# Altium schematic sheet Sensors.SchDoc
size A3
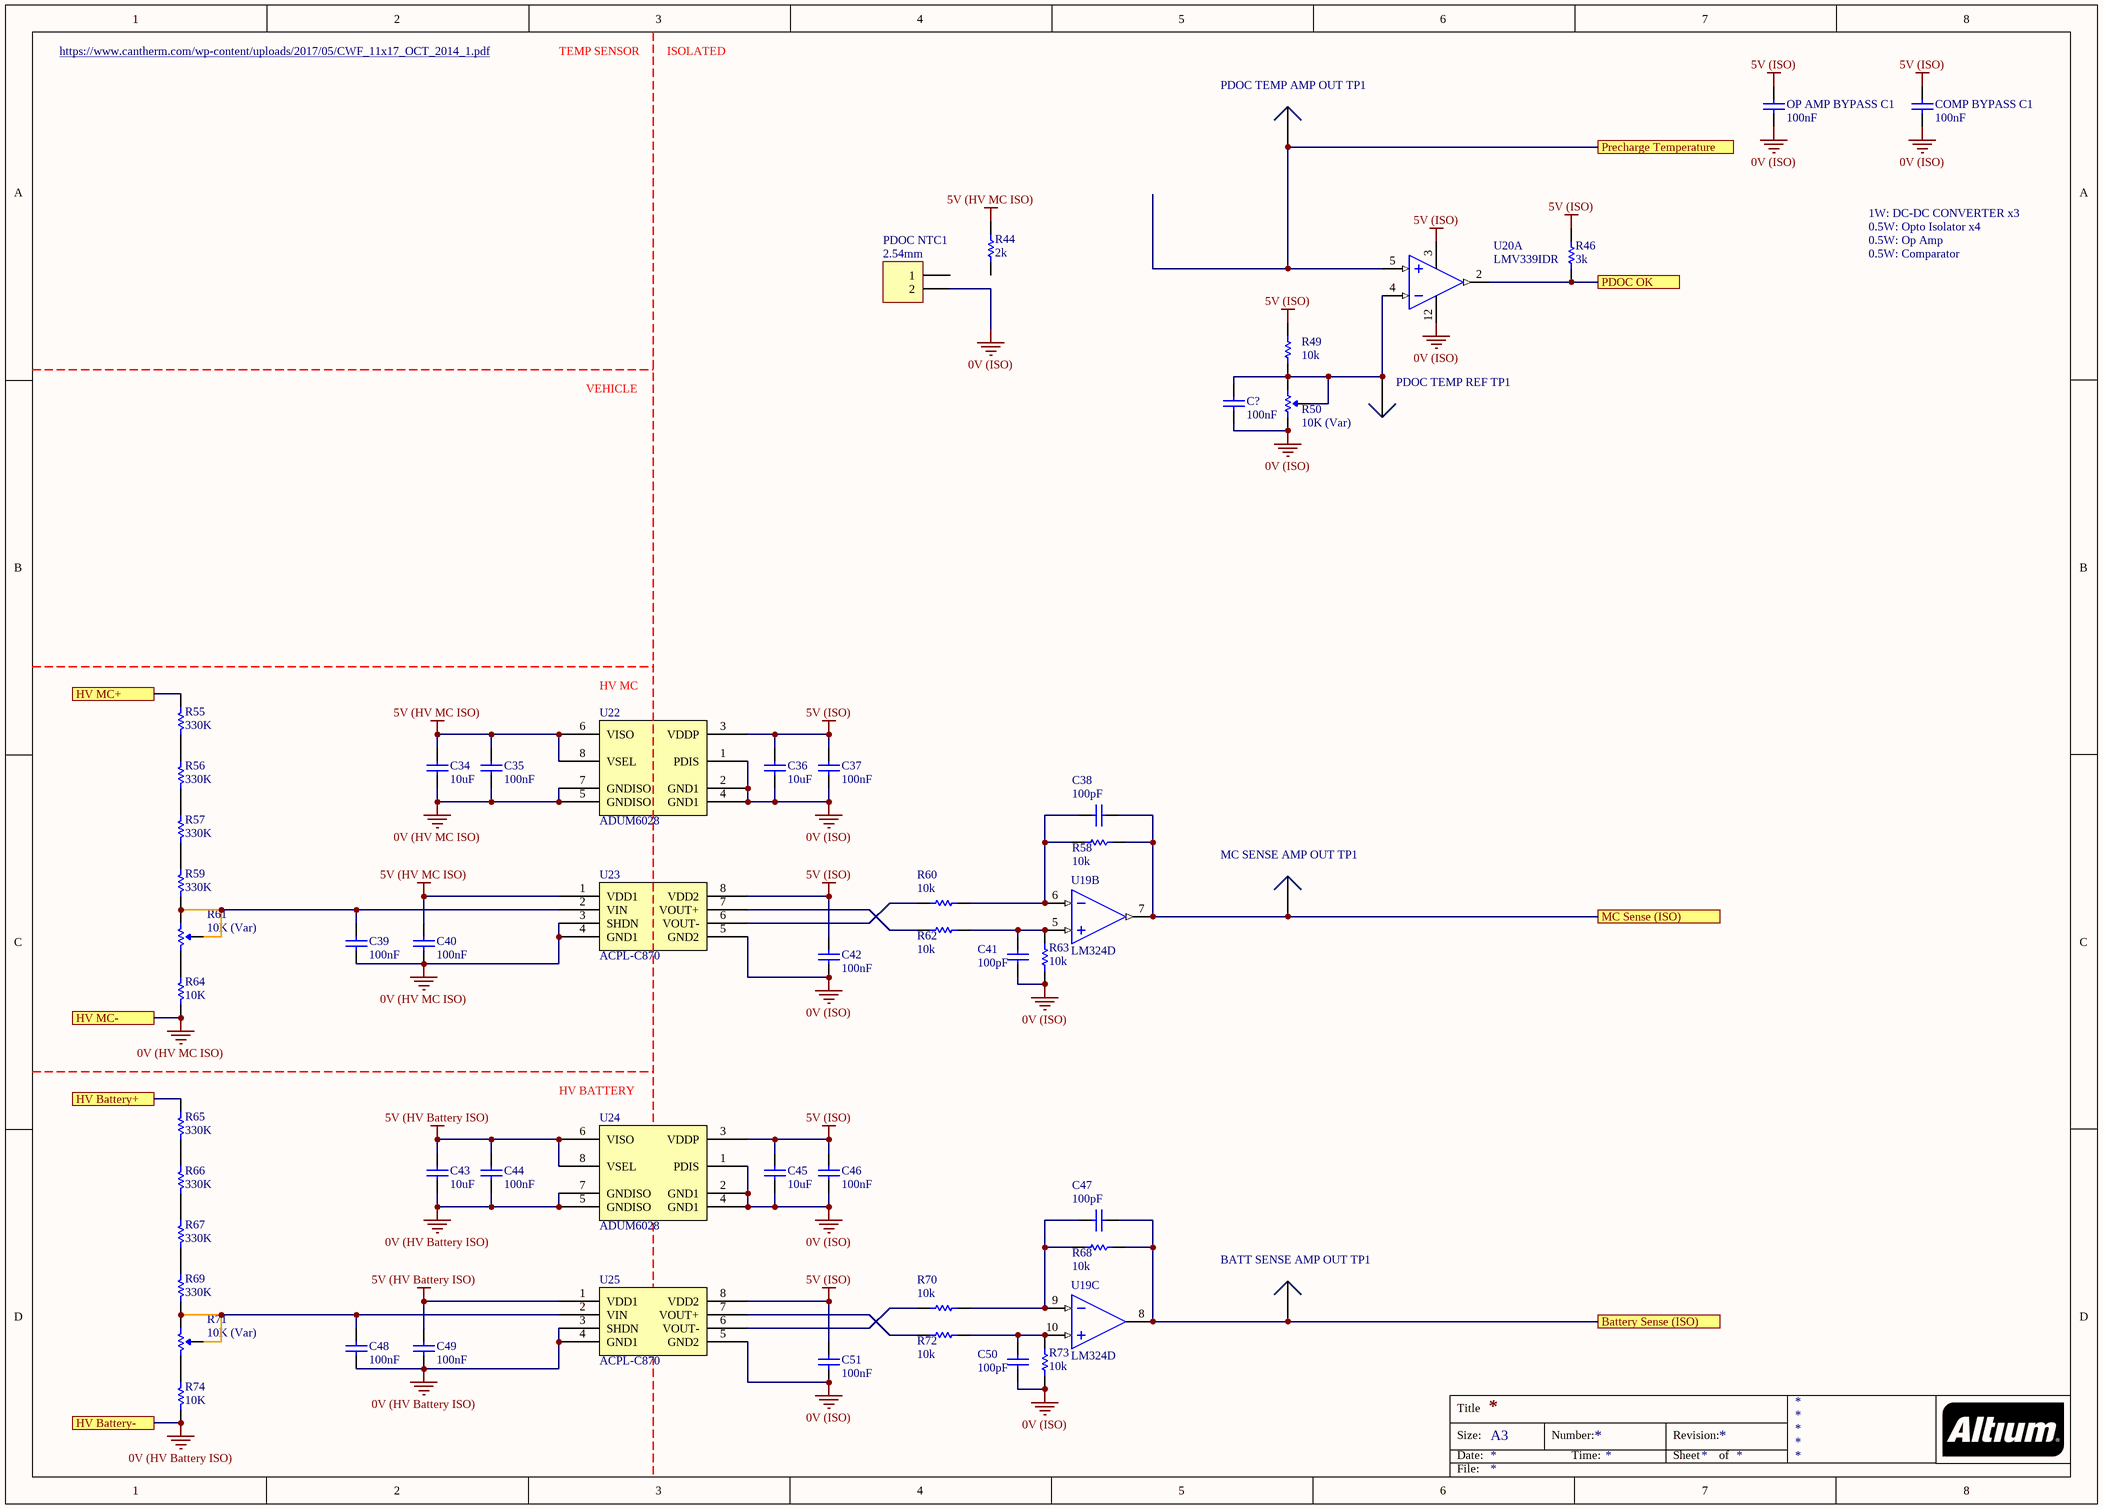
[diagram p0: Sensors.SchDoc]

## Parts
BATT_SENSE_AMP_OUT_TP1  0mm  [SMD Test Point]  (value not drawn)
C34  10uF  [0805]
C35  100nF  [0805]
C36  10uF  [0805]
C37  100nF  [0805]
C38  100pF  [0805]
C39  100nF  [0805]
C40  100nF  [0805]
C41  100pF  [0805]
C42  100nF  [0805]
C43  10uF  [0805]
C44  100nF  [0805]
C45  10uF  [0805]
C46  100nF  [0805]
C47  100pF  [0805]
C48  100nF  [0805]
C49  100nF  [0805]
C50  100pF  [0805]
C51  100nF  [0805]
C?  100nF  [0805]
COMP_BYPASS_C1  100nF  [0805]
MC_SENSE_AMP_OUT_TP1  0mm  [SMD Test Point]  (value not drawn)
OP_AMP_BYPASS_C1  100nF  [0805]
PDOC_NTC1  2.54mm  [TH 2.54mm Header 1x2]
PDOC_TEMP_AMP_OUT_TP1  0mm  [SMD Test Point]  (value not drawn)
PDOC_TEMP_REF_TP1  0mm  [SMD Test Point]  (value not drawn)
R44  2k  [0805]
R46  3k  [0805]
R49  10k  [0805]
R50  10K (Var)  [B 3296]
R55  330K  [VB 0207]
R56  330K  [VB 0207]
R57  330K  [VB 0207]
R58  10k  [0805]
R59  330K  [VB 0207]
R60  10k  [0805]
R61  10K (Var)  [B 3296]
R62  10k  [0805]
R63  10k  [0805]
R64  10K  [VB 0207]
R65  330K  [VB 0207]
R66  330K  [VB 0207]
R67  330K  [VB 0207]
R68  10k  [0805]
R69  330K  [VB 0207]
R70  10k  [0805]
R71  10K (Var)  [B 3296]
R72  10k  [0805]
R73  10k  [0805]
R74  10K  [VB 0207]
U19  LM324D  [TI 14-SOIC]  (parts B,C of 4)
U20  LMV339IDR  [TI 14-SOIC]  (part A of 4)
U22  ADUM6028  [AD 8-SOIC-W]
U23  ACPL-C870  [BROAD 8-SOIC]
U24  ADUM6028  [AD 8-SOIC-W]
U25  ACPL-C870  [BROAD 8-SOIC]

## Ports
Battery Sense (ISO), HV Battery+, HV Battery-, HV MC+, HV MC-, MC Sense (ISO), PDOC OK, Precharge Temperature

## Nets
0V (HV Battery ISO): C43.1 C44.1 C48.1 C49.1 R74.1 U24.5(GNDISO) U24.7(GNDISO) U25.3(SHDN) U25.4(GND1) ; port HV Battery-
0V (HV MC ISO): C34.1 C35.1 C39.1 C40.1 R64.1 U22.5(GNDISO) U22.7(GNDISO) U23.3(SHDN) U23.4(GND1) ; port HV MC-
0V (ISO): C36.1 C37.1 C41.1 C42.1 C45.1 C46.1 C50.1 C51.1 C?.1 COMP_BYPASS_C1.1 OP_AMP_BYPASS_C1.1 PDOC_NTC1.2 R50.3(CW) R63.1 R73.1 U20.12(V-) U22.1(PDIS) U22.2(GND1) U22.4(GND1) U23.5(GND2) U24.1(PDIS) U24.2(GND1) U24.4(GND1) U25.5(GND2)
5V (HV Battery ISO): C43.2 C44.2 C49.2 U24.6(VISO) U24.8(VSEL) U25.1(VDD1)
5V (HV MC ISO): C34.2 C35.2 C40.2 R44.2 U22.6(VISO) U22.8(VSEL) U23.1(VDD1)
5V (ISO): C36.2 C37.2 C42.2 C45.2 C46.2 C51.2 COMP_BYPASS_C1.2 OP_AMP_BYPASS_C1.2 R46.2 R49.2 U20.3(V+) U22.3(VDDP) U23.8(VDD2) U24.3(VDDP) U25.8(VDD2)
Battery Sense (ISO): BATT_SENSE_AMP_OUT_TP1.1 C47.2 R68.2 U19.8(3OUT) ; port Battery Sense (ISO)
HV Battery+: R65.2 ; port HV Battery+
HV MC+: R55.2 ; port HV MC+
MC Sense (ISO): C38.2 MC_SENSE_AMP_OUT_TP1.1 R58.2 U19.7(2OUT) ; port MC Sense (ISO)
PDOC OK: R46.1 U20.2(OUT_A) ; port PDOC OK
Precharge Temperature: PDOC_TEMP_AMP_OUT_TP1.1 U20.5(IN_A+) ; port Precharge Temperature
NetC38_1: C38.1 R58.1 R60.2 U19.6(2IN-)
NetC39_2: C39.2 R59.1 R61.2(Wiper) R61.3(CW) U23.2(VIN)
NetC41_2: C41.2 R62.2 R63.2 U19.5(2IN+)
NetC47_1: C47.1 R68.1 R70.2 U19.9(3IN-)
NetC48_2: C48.2 R69.1 R71.2(Wiper) R71.3(CW) U25.2(VIN)
NetC50_2: C50.2 R72.2 R73.2 U19.10(3IN+)
NetC?_2: C?.2 PDOC_TEMP_REF_TP1.1 R49.1 R50.1(CCW) R50.2(Wiper) U20.4(IN_A-)
NetR55_1: R55.1 R56.2
NetR56_1: R56.1 R57.2
NetR57_1: R57.1 R59.2
NetR60_1: R60.1 U23.6(VOUT-)
NetR61_1: R61.1(CCW) R64.2
NetR62_1: R62.1 U23.7(VOUT+)
NetR65_1: R65.1 R66.2
NetR66_1: R66.1 R67.2
NetR67_1: R67.1 R69.2
NetR70_1: R70.1 U25.6(VOUT-)
NetR71_1: R71.1(CCW) R74.2
NetR72_1: R72.1 U25.7(VOUT+)

Not connected (* = marked no-connect by the designer): PDOC_NTC1 1; R44 1

## Notes on the sheet
- https://www.cantherm.com/wp-content/uploads/2017/05/CWF_11x17_OCT_2014_1.pdf
- TEMP SENSOR
- ISOLATED
- 1W: DC-DC CONVERTER x3
- 0.5W: Opto Isolator x4
- 0.5W: Op Amp
- 0.5W: Comparator
- VEHICLE
- (near U22) HV MC
- (near U24) HV BATTERY
- Title
- Size:
- Date:
- A3
- Number:
- Time:
- Revision:
- Sheet
- of
- File:

## Library data of the parts
BATT_SENSE_AMP_OUT_TP1 MC_SENSE_AMP_OUT_TP1 PDOC_TEMP_AMP_OUT_TP1 PDOC_TEMP_REF_TP1 = SMD Test Point: Positions: 1; Row Spacing: 0; Flange: No; Contact: NA; Part Number: SMD Test Point; Pitch: 0mm; Angle: 0
C34 C36 C43 C45 = GRM21BR6YA106KE43L: Manufacturer: muRata; Tolerance: 10%; Material: X5R; Rated Voltage: 50V; Part Number: GRM21BR6YA106KE43L; Value: 10uF; Digikey Part Number: 490-10514-6-ND
C35 C37 C39 C40 C42 C44 C46 C48 C49 C51 C? = GCM21BR71E104KA37L: Manufacturer: muRata; Tolerance: 10%; Material: X7R; Rated Voltage: 25V; Part Number: GCM21BR71E104KA37L; Value: 100nF
C38 C41 C47 C50 = GCM21B5C1H101JA37L: Manufacturer: muRata; Tolerance: 5%; Material: C0G; Rated Voltage: 50V; Part Number: GCM21B5C1H101JA37L; Value: 100pF
COMP_BYPASS_C1 OP_AMP_BYPASS_C1 = GCM21BR71E104KA37L: Manufacturer: muRata; Tolerance: 10%; Rated Voltage: 25V; Part Number: GCM21BR71E104KA37L; Value: 100nF; Material: X7R
PDOC_NTC1 = TH 2.54mm Header 1x2: Positions: 2; Angle: 0; Flange: No; Contact: NA; Part Number: TH 2.54mm Header 1x2; Pitch: 2.54mm; Row Spacing: 2.54mm
R44 = RC0805FR072KL: Manufacturer: YAGEO; Tolerance: 0.01; Rated Voltage: 0.125W; Part Number: RC0805FR072KL; Value: 2k; Material: FR-07
R46 = RC0805FR073KL: Manufacturer: YAGEO; Tolerance: 0.01; Rated Voltage: 0.125W; Part Number: RC0805FR073KL; Value: 3k; Material: FR-07
R49 R58 R60 R62 R63 R68 R70 R72 R73 = RC0805FR0710KL: Manufacturer: YAGEO; Tolerance: 0.01; Rated Voltage: 0.125W; Part Number: RC0805FR0710KL; Value: 10k; Material: FR-07
R50 R61 R71 = 3296W-1-103LF: Manufacturer: Bournes Inc; Tolerance: 0.1; Rated Voltage: 0.5W; Part Number: 3296W-1-103LF; Value: 10K (Var); Digikey Part Number: 3296W-103LF-ND
R55-R57 R59 R65-R67 R69 = MMB02070C3303FB200: Manufacturer: Vishay Beyschlag; Tolerance: 0.01; Rated Voltage: 1W; Part Number: MMB02070C3303FB200; Value: 330K; Digikey Part Number: MMB-330KBCT-ND
R64 R74 = MMB02070C1002FB200: Manufacturer: Vishay Beyschlag; Tolerance: 0.01; Rated Voltage: 1W; Part Number: MMB02070C1002FB200; Value: 10K; Digikey Part Number: MMB-10KBCT-ND
U19 = LM324D: IC OPAMP GP 4 CIRCUIT 14SOIC; Manufacturer: Texas Instruments; Part Number: LM324D; Digikey Part Number: 296-1390-5-ND; Digikey Link: https://www.digikey.com/product-detail/en/texas-instruments/LM324D/296-1390-5-ND/277039
U20 = LMV339IDR: Comparator General Purpose Open Collector 14-SOIC; Manufacturer: Texas Instruments; Part Number: LMV339IDR; Digikey Part Number: 296-6611-2-ND; Digikey Link: https://www.digikey.com/product-detail/en/texas-instruments/LMV339MTX-NOPB/296-35446-1-ND/3739150
U22 U24 = ADUM6028: Isolated Module DC DC Converter 1 Output 3.3V, 5V 60mA 4.5V - 5.5V Input; Manufacturer: Analog Devices; Output Voltage: 5V, 3.3V; Output Power: 2W; Efficiency: 0.33; Part Number: ADUM6028; Input Voltage: 4.5V-5.5V; Isolation: Isolated; Digikey Part Number: ADUM6028-5BRIZ-ND; Digikey Link: https://www.digikey.com/product-detail/en/analog-devices-inc/ADUM6028-5BRIZ/ADUM6028-5BRIZ-ND/9485494
U23 U25 = ACPL-C870: Isolation Amplifier 1 Circuit Differential 8-SO; Manufacturer: Broadcom Limited; Part Number: ACPL-C870; Digikey Part Number: 516-2578-5-ND; Digikey Link: https://www.digikey.com/product-detail/en/broadcom-limited/ACPL-C870-000E/516-2578-5-ND/3523705